# Altium project PCB_Project.PrjPcb
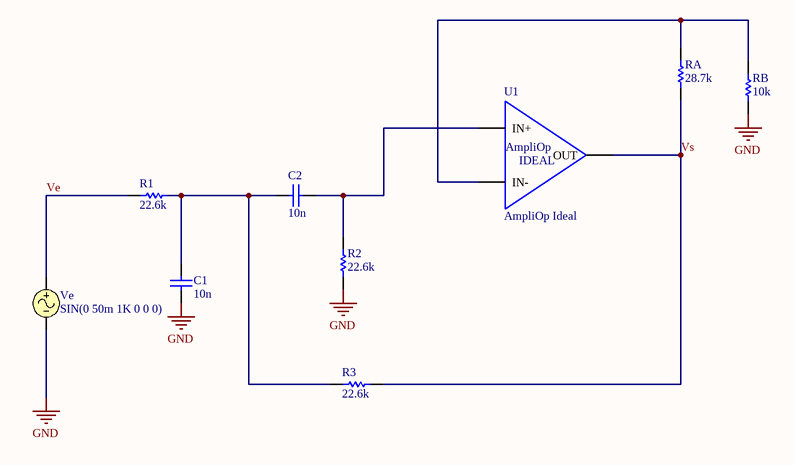
[diagram p0: Sheet1.SchDoc]
1 sheet, 9 parts. Net scope: global (net labels, ports and power ports of the same name join across sheets).

## Sheet Sheet1.SchDoc
size A4; SheetNumber: 1; SheetTotal: 1; SPICEModelCacheIMDYGJVN: <root> / <DocumentId>IMDYGJVN</DocumentId> / <CacheFrame Number="0"> / <Model Name="ideal" Kind="CKT"> / <Text>*IDEAL:Amplificateur operationnel avec gain boucle ouverte de 100K / .SUBCKT IDEAL 1 2 3 / EGAIN 3 0 1 2 1E5 / .ENDS</Text> / </Model> / </CacheFrame> / </root>

### Parts
C1  value 10n  (hidden comment: Capacitor)
C2  value 10n  (hidden comment: Capacitor)
R1  value 22.6k  (hidden comment: Resistor)
R2  value 22.6k  (hidden comment: Resistor)
R3  value 22.6k  (hidden comment: Resistor)
RA  value 28.7k  (hidden comment: Resistor)
RB  value 10k  (hidden comment: Resistor)
U1  AmpliOp Ideal
Ve  SIN(0 50m 1K 0 0 0)

### Nets
GND: C1.1 R2.1 RB.1 Ve.2
Ve: R1.1 Ve.1
Vs: R3.2 RA.1 U1.3(OUT)
NetC1_2: C1.2 C2.1 R1.2 R3.1
NetC2_2: C2.2 R2.2 U1.1(IN+)
NetRA_2: RA.2 RB.2 U1.2(IN-)

### Notes on the sheet
- (in symbol AmpliOp_ideal) AmpliOp; IDEAL

### Library data of the parts
C1 C2 = Capacitor: SimulationGenericComponent: True
R1-R3 RA RB = Resistor: TC1: 0; SimulationGenericComponent: True; TC2: 0
U1 = AmpliOp_ideal
Ve = VSIN: Sinusoidal Voltage Source; Note: PCB Footprint - Not required; Offset: 0; AC Magnitude: 1; Published: 8-Jun-2000; LatestRevisionDate: 15-Nov-2004; LatestRevisionNote: Corrected Netlist.; PackageReference: Not Applicable; Publisher: Altium Limited; Amplitude: 50m; Frequency: 1K; Delay: 0; Damping Factor: 0; Phase: 0; DC Magnitude: 0; AC Phase: 0